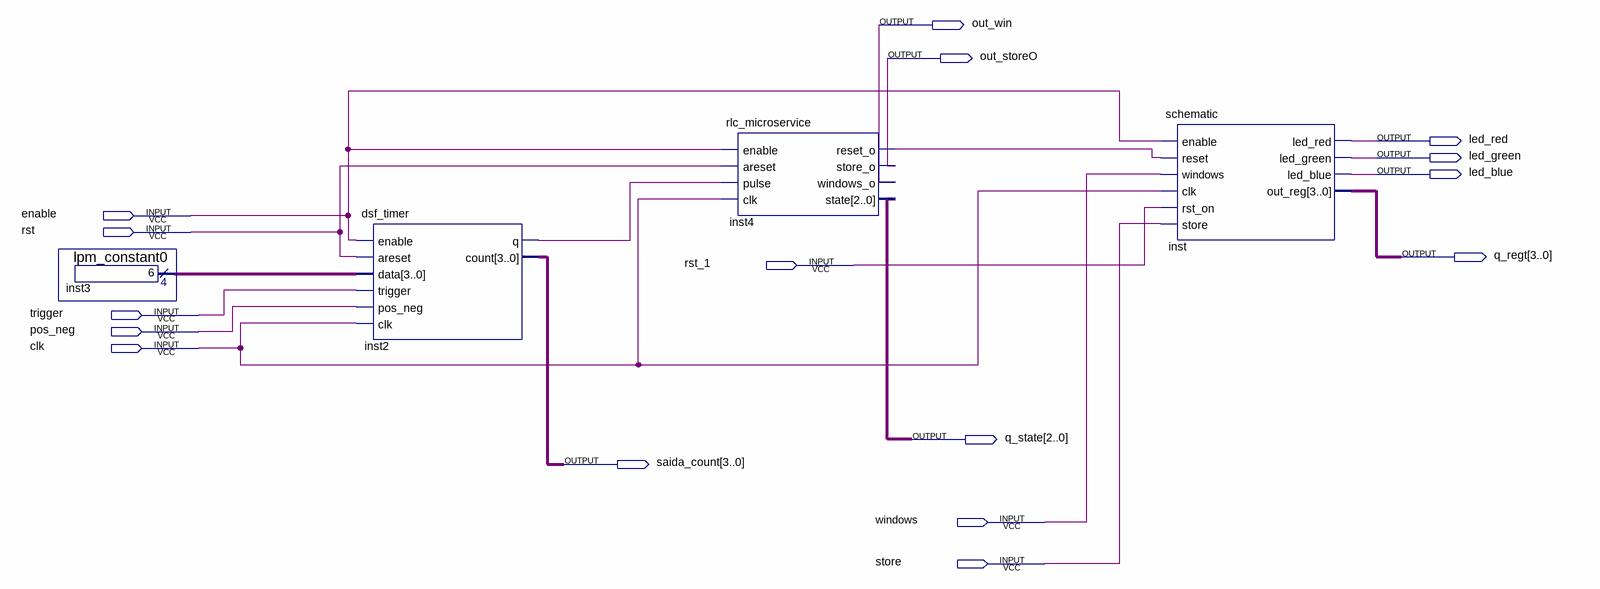
[diagram p0: schematic sheet]
// Quartus schematic radar_eletronico.bdf as structural Verilog: 4 symbols, 16 pins
module radar_eletronico (
  input  enable,
  input  rst,
  input  rst_1,
  input  trigger,
  input  pos_neg,
  input  clk,
  input  windows,
  input  store,
  output out_win,
  output out_storeO,
  output led_red,
  output led_green,
  output led_blue,
  output [3:0] q_regt,
  output [2:0] q_state,
  output [3:0] saida_count
);

  wire inst2_q, inst4_reset_o;
  wire [3:0] inst3_result;

  lpm_constant0 inst3 (.result(inst3_result));
  dsf_timer inst2 (
    .enable(enable), .areset(rst), .data(inst3_result), .trigger(trigger), .pos_neg(pos_neg), .clk(clk),
    .q(inst2_q), .count(saida_count));
  rlc_microservice inst4 (
    .enable(enable), .areset(rst), .pulse(inst2_q), .clk(clk), .reset_o(inst4_reset_o), .store_o(out_storeO),
    .windows_o(out_win), .state(q_state));
  schematic inst (
    .enable(enable), .reset(inst4_reset_o), .windows(windows), .clk(clk), .rst_on(rst_1), .store(store),
    .led_red(led_red), .led_green(led_green), .led_blue(led_blue), .out_reg(q_regt));
endmodule
